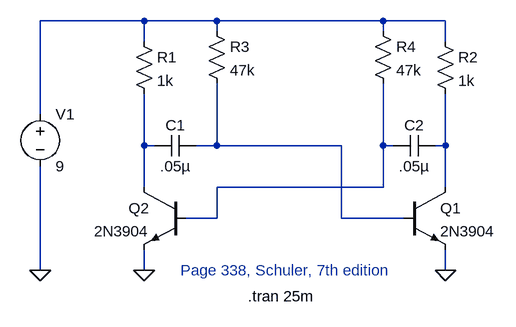
[diagram p0: schematic Disc_astable.asc]
Disc_astable.asc, the LTspice schematic file:
Version 4
SHEET 1 888 1240
WIRE -560 720 -720 720
WIRE -448 720 -560 720
WIRE -192 720 -448 720
WIRE -96 720 -192 720
WIRE -448 736 -448 720
WIRE -192 736 -192 720
WIRE -560 752 -560 720
WIRE -96 752 -96 720
WIRE -720 864 -720 720
WIRE -560 912 -560 832
WIRE -544 912 -560 912
WIRE -448 912 -448 816
WIRE -448 912 -480 912
WIRE -256 912 -448 912
WIRE -192 912 -192 816
WIRE -176 912 -192 912
WIRE -96 912 -96 832
WIRE -96 912 -112 912
WIRE -560 976 -560 912
WIRE -192 976 -192 912
WIRE -192 976 -448 976
WIRE -96 976 -96 912
WIRE -448 1024 -448 976
WIRE -448 1024 -496 1024
WIRE -256 1024 -256 912
WIRE -160 1024 -256 1024
WIRE -720 1104 -720 944
WIRE -560 1104 -560 1072
WIRE -96 1104 -96 1072
FLAG -96 1104 0
FLAG -560 1104 0
FLAG -720 1104 0
SYMBOL RES -576 736 R0
SYMATTR InstName R1
SYMATTR Value 1k
SYMBOL res -112 736 R0
SYMATTR InstName R2
SYMATTR Value 1k
SYMBOL res -464 720 R0
SYMATTR InstName R3
SYMATTR Value 47k
SYMBOL res -208 720 R0
SYMATTR InstName R4
SYMATTR Value 47k
SYMBOL cap -480 896 R90
WINDOW 0 0 32 VBottom 0
WINDOW 3 32 32 VTop 0
SYMATTR InstName C1
SYMATTR Value .05µ
SYMBOL cap -112 896 R90
WINDOW 0 0 32 VBottom 0
WINDOW 3 32 32 VTop 0
SYMATTR InstName C2
SYMATTR Value .05µ
SYMBOL VOLTAGE -720 848 R0
WINDOW 123 0 0 Left 0
WINDOW 39 0 0 Left 0
SYMATTR InstName V1
SYMATTR Value 9
SYMBOL NPN -160 976 R0
SYMATTR InstName Q1
SYMATTR Value 2N3904
SYMBOL npn -496 976 M0
SYMATTR InstName Q2
SYMATTR Value 2N3904
TEXT -400 1144 Left 0 !.tran 25m
TEXT -504 1104 Left 0 ;Page 338, Schuler, 7th edition

The netlist it stands for:
* Disc_astable.asc
R1 N001 N002 1k
R2 N001 N005 1k
R3 N001 N003 47k
R4 N001 N004 47k
C1 N003 N002 .05µ
C2 N005 N004 .05µ
V1 N001 0 9
Q1 N005 N003 0 0 2N3904
Q2 N002 N004 0 0 2N3904
.model NPN NPN
.model PNP PNP
.lib standard.bjt
.tran 25m
* Page 338, Schuler, 7th edition
.backanno
.end